# Altium schematic sheet buttons_and_leds.SchDoc
size 420 x 297 mm; Address1: Address1; Address2: Address2; Address3: Address3; Address4: Address4; SheetNumber: 2; SheetTotal: 6
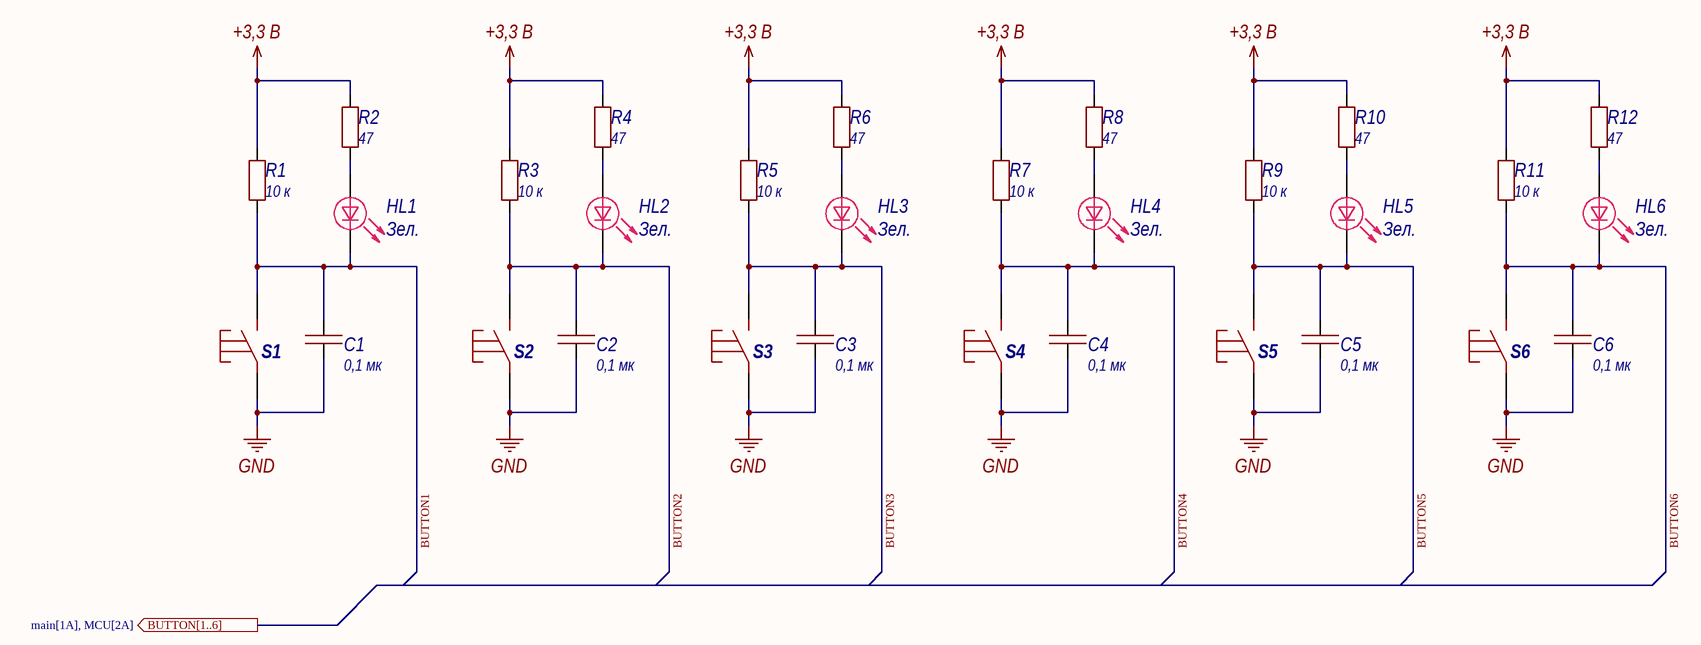
[diagram p0: buttons_and_leds.SchDoc]

## Parts
C1  value 0,1 мк  [0603C]  (hidden comment: Capacitor)
C2  value 0,1 мк  [0603C]  (hidden comment: Capacitor)
C3  value 0,1 мк  [0603C]  (hidden comment: Capacitor)
C4  value 0,1 мк  [0603C]  (hidden comment: Capacitor)
C5  value 0,1 мк  [0603C]  (hidden comment: Capacitor)
C6  value 0,1 мк  [0603C]  (hidden comment: Capacitor)
HL1  Color: Зел.  [0805D]  (hidden comment: LED)
HL2  Color: Зел.  [0805D]  (hidden comment: LED)
HL3  Color: Зел.  [0805D]  (hidden comment: LED)
HL4  Color: Зел.  [0805D]  (hidden comment: LED)
HL5  Color: Зел.  [0805D]  (hidden comment: LED)
HL6  Color: Зел.  [0805D]  (hidden comment: LED)
R1  value 10 к  [0603R]  (hidden comment: Resistor)
R2  value 47  [0603R]  (hidden comment: Resistor)
R3  value 10 к  [0603R]  (hidden comment: Resistor)
R4  value 47  [0603R]  (hidden comment: Resistor)
R5  value 10 к  [0603R]  (hidden comment: Resistor)
R6  value 47  [0603R]  (hidden comment: Resistor)
R7  value 10 к  [0603R]  (hidden comment: Resistor)
R8  value 47  [0603R]  (hidden comment: Resistor)
R9  value 10 к  [0603R]  (hidden comment: Resistor)
R10  value 47  [0603R]  (hidden comment: Resistor)
R11  value 10 к  [0603R]  (hidden comment: Resistor)
R12  value 47  [0603R]  (hidden comment: Resistor)
S1  Button_DIP_12x12  [Button_DIP_12x12]  (value not drawn)
S2  Button_DIP_12x12  [Button_DIP_12x12]  (value not drawn)
S3  Button_DIP_12x12  [Button_DIP_12x12]  (value not drawn)
S4  Button_DIP_12x12  [Button_DIP_12x12]  (value not drawn)
S5  Button_DIP_12x12  [Button_DIP_12x12]  (value not drawn)
S6  Button_DIP_12x12  [Button_DIP_12x12]  (value not drawn)

## Ports
BUTTON[1..6] (out, see main[1A], MCU[2A])

## Nets
+3,3 В: R1.2 R2.2 R3.2 R4.2 R5.2 R6.2 R7.2 R8.2 R9.2 R10.2 R11.2 R12.2
GND: C1.1 C2.1 C3.1 C4.1 C5.1 C6.1 S1.1 S2.1 S3.1 S4.1 S5.1 S6.1
BUTTON1: C1.2 HL1.2 R1.1 S1.2
BUTTON2: C2.2 HL2.2 R3.1 S2.2
BUTTON3: C3.2 HL3.2 R5.1 S3.2
BUTTON4: C4.2 HL4.2 R7.1 S4.2
BUTTON5: C5.2 HL5.2 R9.1 S5.2
BUTTON6: C6.2 HL6.2 R11.1 S6.2
NetHL1_1: HL1.1 R2.1
NetHL2_1: HL2.1 R4.1
NetHL3_1: HL3.1 R6.1
NetHL4_1: HL4.1 R8.1
NetHL5_1: HL5.1 R10.1
NetHL6_1: HL6.1 R12.1

## Notes on the sheet
- Перв. примен.
- Справ. №
- Подп. и дата
- Инв. № дубл.
- Взам. инв. №
- Разраб.
- Изм.
- Лист
- № докум.
- Подп.
- Дата
- Лит.
- Масса
- Масштаб
- Пров.
- Т.контр.
- Схема электрическая принципиальная
- Листов
- Инв. № подл.
- Утв.
- Н.контр.
- Копировал
- Формат А3

## Library data of the parts
C1-C6 = Capacitor_0,1u_10_50V_X7R_0603C: Конденсатор 0603C ёмкостью 0,1 мк 10%, 50 В, X7R; Library Path2: Schematic\Capacitor.SchLib; Voltage (V): 50; Capacity (nF): 100; Part Number: Capacitor_0,1u_10_50V_X7R_0603C; Tolerance: 10%; Dielectric: X7R
HL1-HL6 = LED: Светодиод; Part Number: LED
R1 R3 R5 R7 R9 R11 = Resistor_10k_1_0603: Резистор номиналом 10 кОм 1%; Power: *; Part Number: Resistor_10k_1_0603; Tolerance: 1%
R2 R4 R6 R8 R10 R12 = Resistor_47_1_0603: Резистор номиналом 47 Ом 1%; Power: *; Part Number: Resistor_47_1_0603; Tolerance: 1%
S1-S6 = Button_DIP_12x12: Тактовая кнопка, DIP 12 x 12 мм; Part Number: Button_DIP_12x12